# EAGLE design tube-driver_sch-pcb (EAGLE 9.5.1)

## Sheet 1 of 4: CONTROL
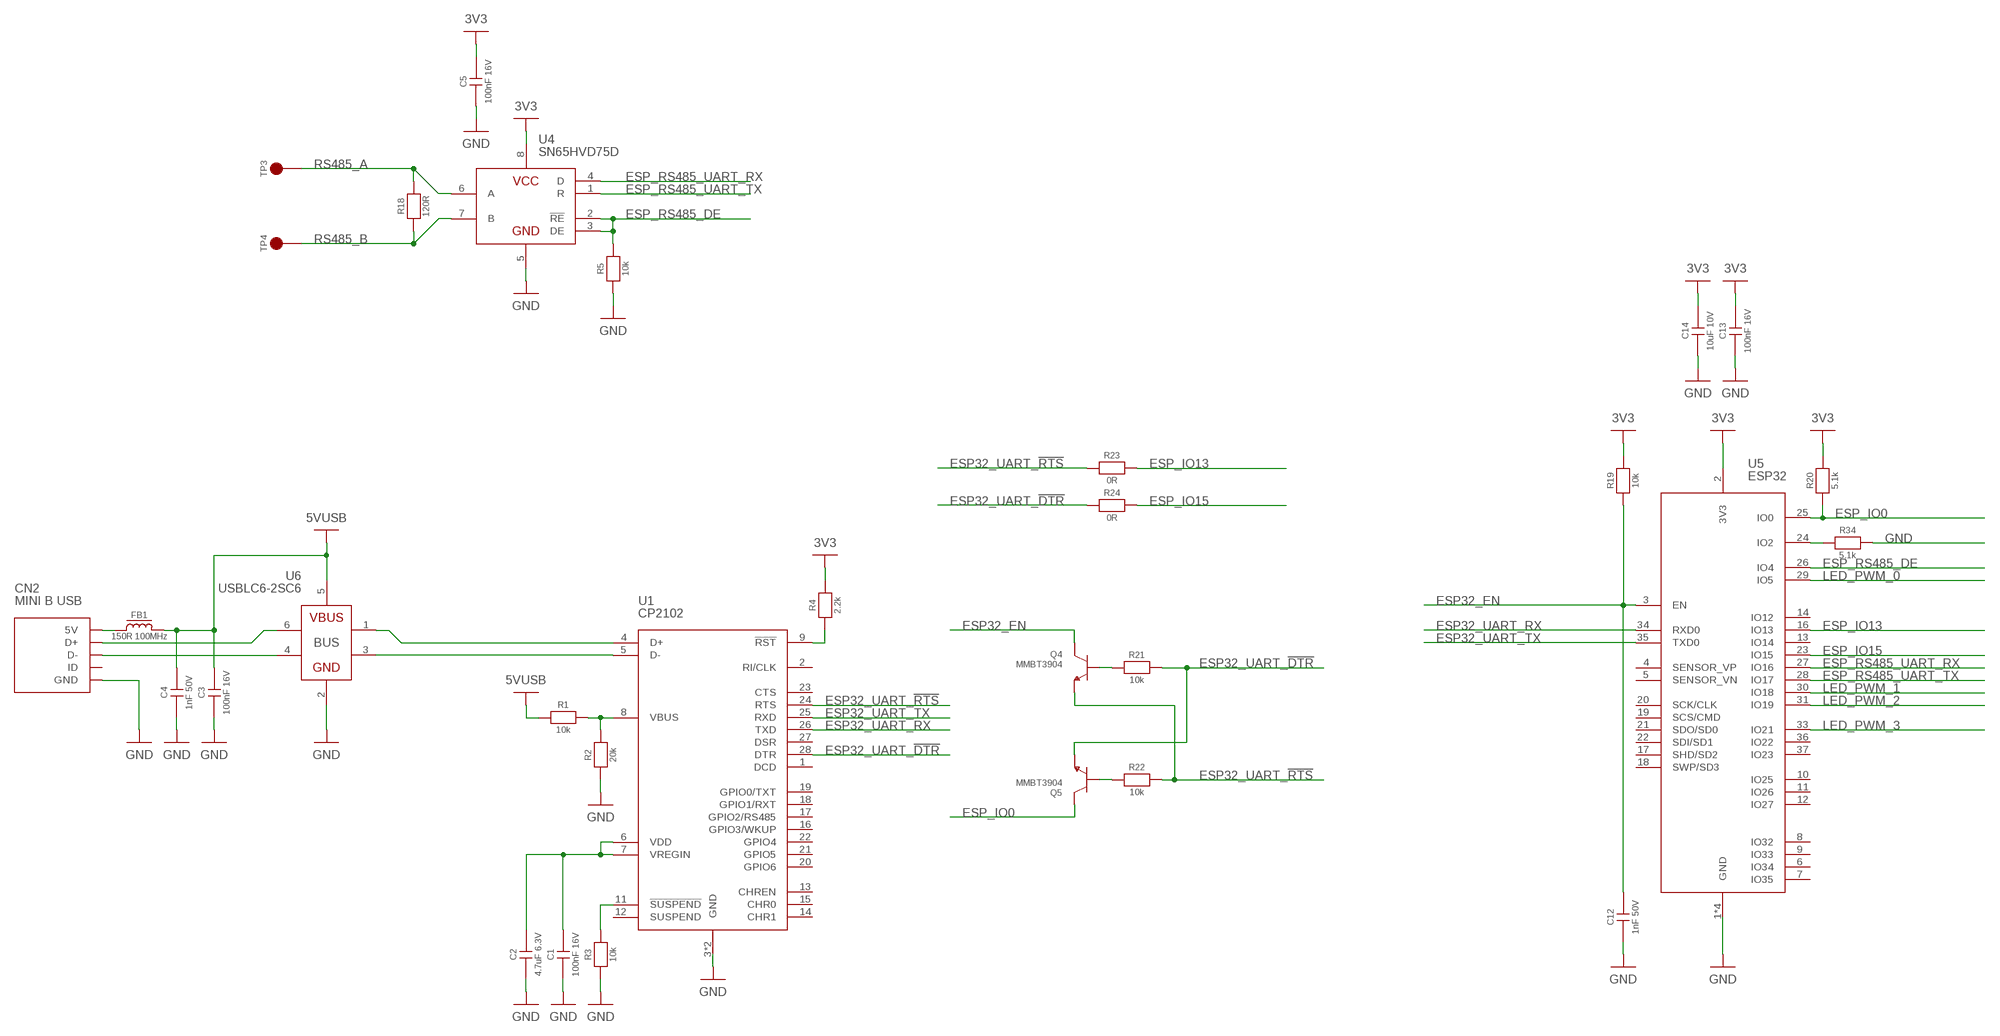
[diagram p0: schematic, sheet 1]

### Parts
C1  100nF 16V  CL10B104KO8WPNC  [0603]
C2  4.7uF 6.3V  GRM188R60J475ME19D  [0603]
C3  100nF 16V  CL10B104KO8WPNC  [0603]
C4  1nF 50V  CL10B102KB8NNNC  [0603]
C5  100nF 16V  CL10B104KO8WPNC  [0603]
C12  1nF 50V  CL10B102KB8NNNC  [0603]
C13  100nF 16V  CL10B104KO8WPNC  [0603]
C14  10uF 10V  GRM188R61A106KE69D  [0603]
CN2  MINI B USB  MUSB-05-S-B-SM-A  [MUSB-05-S-B-SM-A]
FB1  150R 100MHz  ILB1206ER151V  [1206]
Q4  MMBT3904  MMBT3904-7-F  [SOT23-3]
Q5  MMBT3904  MMBT3904-7-F  [SOT23-3]
R1  10k  ERJ3EKF1002V  [0603]
R2  20k  ERJ3EKF2002V  [0603]
R3  10k  ERJ3EKF1002V  [0603]
R4  2.2k  ERJ3EKF2201V  [0603]
R5  10k  ERJ3EKF1002V  [0603]
R18  120R  ERJ3EKF1200V  [0603]
R19  10k  ERJ3EKF1002V  [0603]
R20  5.1k  ERJ3EKF5101V  [0603]
R21  10k  ERJ3EKF1002V  [0603]
R22  10k  ERJ3EKF1002V  [0603]
R23  0R  CRCW06030000Z0EA  [0603]
R24  0R  CRCW06030000Z0EA  [0603]
R34  5.1k  ERJ3EKF5101V  [0603]
TP3  2MM_TEST_POINT  [2MM_TEST_PAD]
TP4  2MM_TEST_POINT  [2MM_TEST_PAD]
U1  CP2102  CP2102N-A01-GQFN28  [QFN28]
U4  SN65HVD75D  [SO8]
U5  ESP32  ESP32-WROOM-32D  [ESP32-WROOM-32D]
U6  USBLC6-2SC6  [SOT23-6]

### Nets
3V3: C5.2 C13.2 C14.2 R4.2 R19.2 R20.2 U4.8(VCC) U5.2(3V3) ; also sheet 3
5VUSB: C3.2 C4.2 FB1.2 R1.1 U6.5(VBUS) ; also sheet 3
ESP32_EN: C12.2 Q4.2(C) R19.1 U5.3(EN)
ESP32_UART_!DTR: Q5.3(E) R21.2 R24.1 U1.28(DTR)
ESP32_UART_!RTS: Q4.3(E) R22.2 R23.1 U1.24(RTS)
ESP32_UART_RX: U1.26(TXD) U5.34(RXD0)
ESP32_UART_TX: U1.25(RXD) U5.35(TXD0)
ESP_IO0: Q5.2(C) R20.1 U5.25(IO0)
ESP_IO13: R23.2 U5.16(IO13)
ESP_IO15: R24.2 U5.23(IO15)
ESP_RS485_DE: R5.2 U4.2(!RE) U4.3(DE) U5.26(IO4)
ESP_RS485_UART_RX: U4.4(D) U5.27(IO16)
ESP_RS485_UART_TX: U4.1(R) U5.28(IO17)
GND: C1.1 C2.1 C3.1 C4.1 C5.1 C12.1 C13.1 C14.1 CN2.GND CN2.SHIELD1(GND) CN2.SHIELD2(GND) CN2.SHIELD3(GND) CN2.SHIELD4(GND) R2.1 R3.1 R5.1 R34.2 U1.3(GND) U1.29(GND) U4.5(GND) U5.1(GND) U5.15(GND) U5.38(GND) U5.39(GND) U6.2(GND) ; also sheet 2,3
LED_PWM_0: U5.29(IO5) ; also sheet 2
LED_PWM_1: U5.30(IO18) ; also sheet 2
LED_PWM_2: U5.31(IO19) ; also sheet 2
LED_PWM_3: U5.33(IO21) ; also sheet 2
N$1: R1.2 R2.2 U1.8(VBUS)
N$2: R4.1 U1.9(!RST)
N$3: R3.2 U1.11(!SUSPEND)
N$7: C1.2 C2.2 U1.6(VDD) U1.7(VREGIN)
N$13: R34.1 U5.24(IO2)
N$20: CN2.VCC(5V) FB1.1
N$95: CN2.D- U6.4(D-OUT)
N$96: CN2.D+ U6.6(D+_OUT)
N$97: U1.5(D-) U6.3(D-_IN)
N$98: U1.4(D+) U6.1(D+_IN)
N$99: Q4.1(B) R21.1
N$100: Q5.1(B) R22.1
RS485_A: R18.2 TP3.1 U4.6(A)
RS485_B: R18.1 TP4.1 U4.7(B)
Unconnected: CN2.ID U1.1(DCD) U1.2(RI/CLK) U1.12(SUSPEND) U1.13(CHREN) U1.14(CHR1) U1.15(CHR0) U1.16(GPIO3/WKUP) U1.17(GPIO2/RS485) U1.18(GPIO1/RXT) U1.19(GPIO0/TXT) U1.20(GPIO6) U1.21(GPIO5) U1.22(GPIO4) U1.23(CTS) U1.27(DSR) U5.4(SENSOR_VP) U5.5(SENSOR_VN) U5.6(IO34) U5.7(IO35) U5.8(IO32) U5.9(IO33) U5.10(IO25) U5.11(IO26) U5.12(IO27) U5.13(IO14) U5.14(IO12) U5.17(SHD/SD2) U5.18(SWP/SD3) U5.19(SCS/CMD) U5.20(SCK/CLK) U5.21(SDO/SD0) U5.22(SDI/SD1) U5.36(IO22) U5.37(IO23)

## Sheet 2 of 4: LEDS
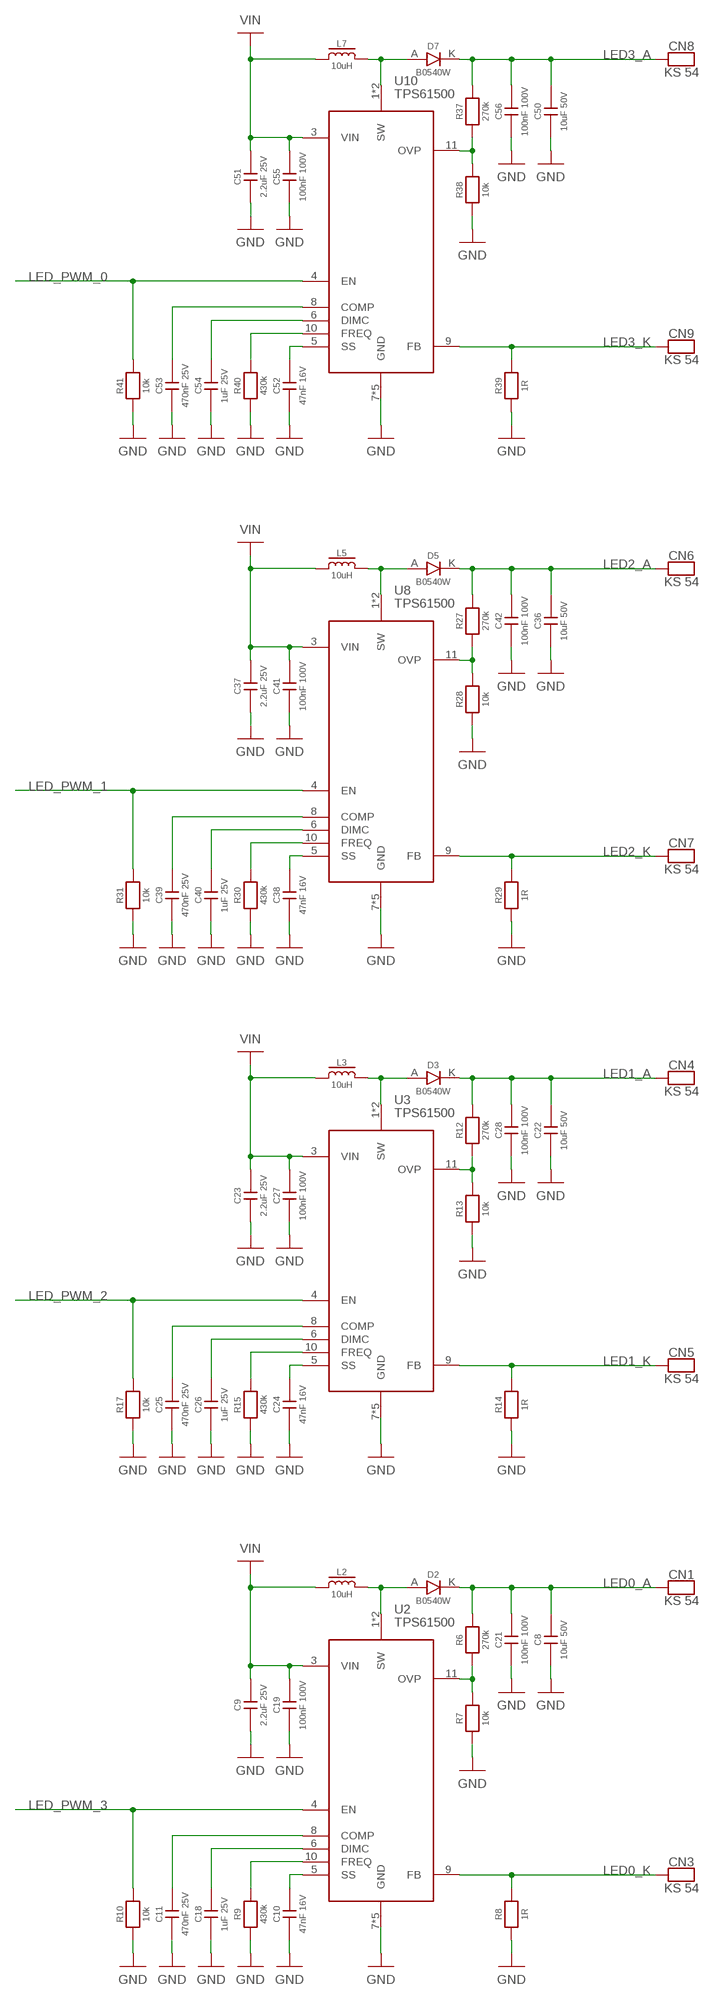
[diagram p1: schematic, sheet 2]

### Parts
C8  10uF 50V  C3225X7S1H106M250AB  [1210]
C9  2.2uF 25V  GRM188R61E225KA12D  [0603]
C10  47nF 16V  CL10B473KO8NNNC  [0603]
C11  470nF 25V  GRM188R71E474KA12D  [0603]
C18  1uF 25V  CL10A105KA8NNNC  [0603]
C19  100nF 100V  06031C104KAT2A  [0603]
C21  100nF 100V  06031C104KAT2A  [0603]
C22  10uF 50V  C3225X7S1H106M250AB  [1210]
C23  2.2uF 25V  GRM188R61E225KA12D  [0603]
C24  47nF 16V  CL10B473KO8NNNC  [0603]
C25  470nF 25V  GRM188R71E474KA12D  [0603]
C26  1uF 25V  CL10A105KA8NNNC  [0603]
C27  100nF 100V  06031C104KAT2A  [0603]
C28  100nF 100V  06031C104KAT2A  [0603]
C36  10uF 50V  C3225X7S1H106M250AB  [1210]
C37  2.2uF 25V  GRM188R61E225KA12D  [0603]
C38  47nF 16V  CL10B473KO8NNNC  [0603]
C39  470nF 25V  GRM188R71E474KA12D  [0603]
C40  1uF 25V  CL10A105KA8NNNC  [0603]
C41  100nF 100V  06031C104KAT2A  [0603]
C42  100nF 100V  06031C104KAT2A  [0603]
C50  10uF 50V  C3225X7S1H106M250AB  [1210]
C51  2.2uF 25V  GRM188R61E225KA12D  [0603]
C52  47nF 16V  CL10B473KO8NNNC  [0603]
C53  470nF 25V  GRM188R71E474KA12D  [0603]
C54  1uF 25V  CL10A105KA8NNNC  [0603]
C55  100nF 100V  06031C104KAT2A  [0603]
C56  100nF 100V  06031C104KAT2A  [0603]
CN1  KS 54  KEYSTONE_54  [KEYSTONE_54]
CN3  KS 54  KEYSTONE_54  [KEYSTONE_54]
CN4  KS 54  KEYSTONE_54  [KEYSTONE_54]
CN5  KS 54  KEYSTONE_54  [KEYSTONE_54]
CN6  KS 54  KEYSTONE_54  [KEYSTONE_54]
CN7  KS 54  KEYSTONE_54  [KEYSTONE_54]
CN8  KS 54  KEYSTONE_54  [KEYSTONE_54]
CN9  KS 54  KEYSTONE_54  [KEYSTONE_54]
D2  B0540W  [SOD-123]
D3  B0540W  [SOD-123]
D5  B0540W  [SOD-123]
D7  B0540W  [SOD-123]
L2  10uH  SRN6045-100M  [SRN6045]
L3  10uH  SRN6045-100M  [SRN6045]
L5  10uH  SRN6045-100M  [SRN6045]
L7  10uH  SRN6045-100M  [SRN6045]
R6  270k  ERJ3EKF2703V  [0603]
R7  10k  ERJ3EKF1002V  [0603]
R8  1R  CRCW12061R00FKEA  [1206]
R9  430k  ERJ3EKF4303V  [0603]
R10  10k  ERJ3EKF1002V  [0603]
R12  270k  ERJ3EKF2703V  [0603]
R13  10k  ERJ3EKF1002V  [0603]
R14  1R  CRCW12061R00FKEA  [1206]
R15  430k  ERJ3EKF4303V  [0603]
R17  10k  ERJ3EKF1002V  [0603]
R27  270k  ERJ3EKF2703V  [0603]
R28  10k  ERJ3EKF1002V  [0603]
R29  1R  CRCW12061R00FKEA  [1206]
R30  430k  ERJ3EKF4303V  [0603]
R31  10k  ERJ3EKF1002V  [0603]
R37  270k  ERJ3EKF2703V  [0603]
R38  10k  ERJ3EKF1002V  [0603]
R39  1R  CRCW12061R00FKEA  [1206]
R40  430k  ERJ3EKF4303V  [0603]
R41  10k  ERJ3EKF1002V  [0603]
U2  TPS61500  [HTSSOP14-4.5]
U3  TPS61500  [HTSSOP14-4.5]
U8  TPS61500  [HTSSOP14-4.5]
U10  TPS61500  [HTSSOP14-4.5]

### Nets
GND: C8.1 C9.1 C10.1 C11.1 C18.1 C19.1 C21.1 C22.1 C23.1 C24.1 C25.1 C26.1 C27.1 C28.1 C36.1 C37.1 C38.1 C39.1 C40.1 C41.1 C42.1 C50.1 C51.1 C52.1 C53.1 C54.1 C55.1 C56.1 R7.1 R8.1 R9.1 R10.1 R13.1 R14.1 R15.1 R17.1 R28.1 R29.1 R30.1 R31.1 R38.1 R39.1 R40.1 R41.1 U2.7(GND) U2.12(GND) U2.13(GND) U2.14(GND) U2.PAD(GND) U3.7(GND) U3.12(GND) U3.13(GND) U3.14(GND) U3.PAD(GND) U8.7(GND) U8.12(GND) U8.13(GND) U8.14(GND) U8.PAD(GND) U10.7(GND) U10.12(GND) U10.13(GND) U10.14(GND) U10.PAD(GND) ; also sheet 1,3
LED0_A: C8.2 C21.2 CN1.P$1 CN1.P$2 CN1.P$3 D2.K R6.2
LED0_K: CN3.P$1 CN3.P$2 CN3.P$3 R8.2 U2.9(FB)
LED1_A: C22.2 C28.2 CN4.P$1 CN4.P$2 CN4.P$3 D3.K R12.2
LED1_K: CN5.P$1 CN5.P$2 CN5.P$3 R14.2 U3.9(FB)
LED2_A: C36.2 C42.2 CN6.P$1 CN6.P$2 CN6.P$3 D5.K R27.2
LED2_K: CN7.P$1 CN7.P$2 CN7.P$3 R29.2 U8.9(FB)
LED3_A: C50.2 C56.2 CN8.P$1 CN8.P$2 CN8.P$3 D7.K R37.2
LED3_K: CN9.P$1 CN9.P$2 CN9.P$3 R39.2 U10.9(FB)
LED_PWM_0: R41.2 U10.4(EN) ; also sheet 1
LED_PWM_1: R31.2 U8.4(EN) ; also sheet 1
LED_PWM_2: R17.2 U3.4(EN) ; also sheet 1
LED_PWM_3: R10.2 U2.4(EN) ; also sheet 1
N$6: C10.2 U2.5(SS)
N$8: R9.2 U2.10(FREQ)
N$9: C18.2 U2.6(DIMC)
N$10: C11.2 U2.8(COMP)
N$11: R6.1 R7.2 U2.11(OVP)
N$12: D2.A L2.2 U2.1(SW) U2.2(SW)
N$14: C24.2 U3.5(SS)
N$15: R15.2 U3.10(FREQ)
N$16: C26.2 U3.6(DIMC)
N$17: C25.2 U3.8(COMP)
N$18: R12.1 R13.2 U3.11(OVP)
N$19: D3.A L3.2 U3.1(SW) U3.2(SW)
N$26: C38.2 U8.5(SS)
N$27: R30.2 U8.10(FREQ)
N$28: C40.2 U8.6(DIMC)
N$29: C39.2 U8.8(COMP)
N$30: R27.1 R28.2 U8.11(OVP)
N$31: D5.A L5.2 U8.1(SW) U8.2(SW)
N$38: C52.2 U10.5(SS)
N$39: R40.2 U10.10(FREQ)
N$40: C54.2 U10.6(DIMC)
N$41: C53.2 U10.8(COMP)
N$42: R37.1 R38.2 U10.11(OVP)
N$43: D7.A L7.2 U10.1(SW) U10.2(SW)
VIN: C9.2 C19.2 C23.2 C27.2 C37.2 C41.2 C51.2 C55.2 L2.1 L3.1 L5.1 L7.1 U2.3(VIN) U3.3(VIN) U8.3(VIN) U10.3(VIN) ; also sheet 3

## Sheet 3 of 4: PSU
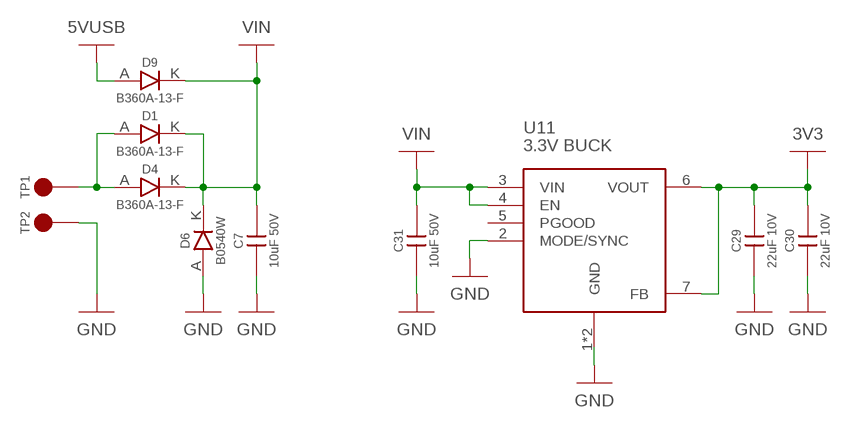
[diagram p2: schematic, sheet 3]

### Parts
C7  10uF 50V  C3225X7S1H106M250AB  [1210]
C29  22uF 10V  CL31B226MPHNNNE  [1206]
C30  22uF 10V  CL31B226MPHNNNE  [1206]
C31  10uF 50V  C3225X7S1H106M250AB  [1210]
D1  B360A-13-F  [DO214AC]
D4  B360A-13-F  [DO214AC]
D6  B0540W  [SOD-123]
D9  B360A-13-F  [DO214AC]
TP1  2MM_TEST_POINT  [2MM_TEST_PAD]
TP2  2MM_TEST_POINT  [2MM_TEST_PAD]
U11  3.3V BUCK  LMZM23600V3SILT  [TI_MICROSIP_10]

### Nets
3V3: C29.2 C30.2 U11.6(VOUT) U11.7(FB) ; also sheet 1
5VUSB: D9.A ; also sheet 1
GND: C7.1 C29.1 C30.1 C31.1 D6.A TP2.1 U11.1(GND) U11.2(MODE/SYNC) U11.PAD(GND) ; also sheet 1,2
N$5: D1.A D4.A TP1.1
VIN: C7.2 C31.2 D1.K D4.K D6.K D9.K U11.3(VIN) U11.4(EN) ; also sheet 2
Unconnected: U11.5(PGOOD)

## Sheet 4 of 4
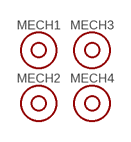
[diagram p3: schematic, sheet 4]

### Parts
MECH1  6mm x 3mm  MOUNTHOLE  [MOUNTHOLE_6X3]
MECH2  6mm x 3mm  MOUNTHOLE  [MOUNTHOLE_6X3]
MECH3  6mm x 3mm  MOUNTHOLE  [MOUNTHOLE_6X3]
MECH4  6mm x 3mm  MOUNTHOLE  [MOUNTHOLE_6X3]

## Library data of the parts
C1 C3 C5 C13 = CAPACITORS:CL10B104KO8WPNC: 100nF 16V X7R 10% 0603 MLCC; DIGIKEY: 1276-6582-1-ND; HEIGHT: 1; PRICE_PER: 0.08
C2 = CAPACITORS:GRM188R60J475ME19D: 4.7uF 6.3V X5R 10% 0603 MLCC.; FARNELL: 2362095; HEIGHT: 1; PRICE_PER: 0.0414
C4 C12 = CAPACITORS:CL10B102KB8NNNC: 1nF 50V X7R 10% 0603 MLCC.; DIGIKEY: 1276-1018-1-ND; HEIGHT: 1; PRICE_PER: 0.08
C7 C8 C22 C31 C36 C50 = CAPACITORS:C3225X7S1H106M250AB: 10uF 50V X7S 20% 1210 MLCC.; DIGIKEY: 445-4537-1-ND; HEIGHT: 3; PRICE_PER: 0.583
C9 C23 C37 C51 = CAPACITORS:GRM188R61E225KA12D: 2.2uF 25V X5R 10% 0603 MLCC.; DIGIKEY: 490-10731-1-ND; HEIGHT: 1; PRICE_PER: 0.14
C10 C24 C38 C52 = CAPACITORS:CL10B473KO8NNNC: 47nF 16V X7R 10% 0603 MLCC.; DIGIKEY: 1276-2079-1-ND; HEIGHT: 1; PRICE_PER: 0.08
C11 C25 C39 C53 = CAPACITORS:GRM188R71E474KA12D: 470nF 25V X7R 10% 0603 MLCC.; DIGIKEY: 490-3291-1-ND; HEIGHT: 1; PRICE_PER: 0.2
C14 = CAPACITORS:GRM188R61A106KE69D: 10uF 10V X5R 10% 0603 MLCC.; DIGIKEY: 490-10474-1-ND; HEIGHT: 0.95; PRICE_PER: 0.17
C18 C26 C40 C54 = CAPACITORS:CL10A105KA8NNNC: 1uF 25V X5R 10% 0603 MLCC.; DIGIKEY: 1276-1102-1-ND; HEIGHT: 1; PRICE_PER: 0.08
C19 C21 C27 C28 C41 C42 C55 C56 = CAPACITORS:06031C104KAT2A: 100nF 100V X7R 10% 0603 MLCC.; DIGIKEY: 478-10047-1-ND; HEIGHT: 1; PRICE_PER: 0.14
C29 C30 = CAPACITORS:CL31B226MPHNNNE: 22uF 10V X7R 10% 1206 MLCC.; DIGIKEY: 1276-3148-6-ND; HEIGHT: 1.8; PRICE_PER: 0.47
CN1 CN3-CN9 = CONNECTORs:KEYSTONE_54: Battery Contact Clip 18650 1 Cell PC Pin; DIGIKEY: 36-54-ND; HEIGHT: 17; PRICE_PER: 0.46
CN2 = CONNECTORs:MUSB-05-S-B-SM-A: 5 pin, SMD, mini USB connector.; DIGIKEY: SAM8841-ND; HEIGHT: 4; PRICE_PER: 1.11
D1 D4 D9 = DIODES:B360A-13-F: Schottky Rectifier, 60 V, 3 A, Single, DO-214AC, 2 Pins, 700 mV; DIGIKEY: B360A-FDICT-ND; HEIGHT: 2; PRICE_PER: 0.31
D2 D3 D5-D7 = DIODES:B0540W: 410mW, Low VF SMD Schottky Barrier Diode; DIGIKEY: B0540W-FDICT-ND; HEIGHT: 1; PRICE_PER: 0.153
FB1 = INDUCTORS:ILB1206ER151V: Ferrite bead, 100MHz, 150R, 0.8A, 1206; DIGIKEY: 541-2281-1-ND; HEIGHT: 1.5; PRICE_PER: 0.14
L2 L3 L5 L7 = INDUCTORS:SRN6045-100M: BOURNS SRN6045-100M Surface Mount Power Inductor, SRN6045 Series, 10 µH, 2.5 A, 3 A, Shielded, 0.0586 ohm; DIGIKEY: SRN6045-100MCT-ND; HEIGHT: 5; PRICE_PER: 0.45
MECH1-MECH4 = MISC:MOUNTHOLE: Mechanical mounting hole.
Q4 Q5 = TRANSISTORs:MMBT3904-7-F: Bipolar (BJT) Transistor NPN 40V 200mA 300MHz 300mW Surface Mount SOT-23-3; DIGIKEY: MMBT3904-FDICT-ND; HEIGHT: 0.8; PRICE_PER: 0.1
R1 R3 R5 R7 R10 R13 R17 R19 R21 R22 R28 R31 R38 R41 = r_0603:ERJ3EKF1002V: 10000 10k 0603 0.1W 1% thick film resistor.; DIGIKEY: P10.0KHCT-ND; PRICE_PER: 0.10000
R2 = r_0603:ERJ3EKF2002V: 20000 20k 0603 0.1W 1% thick film resistor.; DIGIKEY: P20.0KHCT-ND; PRICE_PER: 0.10000
R4 = r_0603:ERJ3EKF2201V: 2200 2.2k 0603 0.1W 1% thick film resistor.; DIGIKEY: P2.20KHCT-ND; PRICE_PER: 0.10000
R6 R12 R27 R37 = r_0603:ERJ3EKF2703V: 270000 270k 0603 0.1W 1% thick film resistor.; DIGIKEY: P270KHCT-ND; PRICE_PER: 0.10000
R8 R14 R29 R39 = RESISTORS:CRCW12061R00FKEA: 1 1R0 1206 0.25W 1% thick film resistor.; DIGIKEY: 541-1.00FFCT-ND; HEIGHT: 0.65; PRICE_PER: 0.08
R9 R15 R30 R40 = r_0603:ERJ3EKF4303V: 430000 430k 0603 0.1W 1% thick film resistor.; DIGIKEY: P430KHCT-ND; PRICE_PER: 0.10000
R18 = r_0603:ERJ3EKF1200V: 120 120R 0603 0.1W 1% thick film resistor.; DIGIKEY: P120HCT-ND; PRICE_PER: 0.10000
R20 R34 = r_0603:ERJ3EKF5101V: 5100 5.1k 0603 0.1W 1% thick film resistor.; DIGIKEY: P5.10KHCT-ND; PRICE_PER: 0.10000
R23 R24 = RESISTORS:CRCW06030000Z0EA: 0 0R 0603 0.1W thick film resistor; DIGIKEY: 541-0.0GCT-ND; HEIGHT: 0.5; PRICE_PER: 0.08
TP1-TP4 = MISC:2MM_TEST_POINT: A 2MM round pad for test purposes.
U1 = ICs:CP2102N-A01-GQFN28: USB Bridge, USB to UART USB 2.0 UART Interface 28-QFN (5x5); DIGIKEY: 336-3694-ND; HEIGHT: 1.2; PRICE_PER: 1.09
U2 U3 U8 U10 = ICs:TPS61500: TPS61500 High-Brightness, LED Driver With Integrated 3-A, 40-V Power Switch; DIGIKEY: 296-24014-1-ND; HEIGHT: 1; PRICE_PER: 1.95
U4 = ICs:SN65HVD75D: 3.3-V Supply RS-485 With IEC ESD protection; DIGIKEY: 296-38570-1-ND; HEIGHT: 1.8; PRICE_PER: 2.09
U5 = ICs:ESP32-WROOM-32D: Bluetooth, WiFi 802.11b/g/n, Bluetooth v4.2 + EDR, Class 1, 2 and 3 Transceiver Module 2.4GHz ~ 2.5GHz Integrated, Trace Surface Mount; DIGIKEY: 1904-1023-1-ND; HEIGHT: 5; PRICE_PER: 3.01
U6 = ICs:USBLC6-2SC6: Very low capacitance ESD protection; DIGIKEY: 497-5235-1-ND; HEIGHT: 1.5; PRICE_PER: 0.38
U11 = ICs:LMZM23600V3SILT: 36-V, 0.5-A Step-Down DC/DC Power Module in 3.8-mm × 3-mm Package; DIGIKEY: 296-49458-1-ND; HEIGHT: 1.6; PRICE_PER: 4.24

## Board
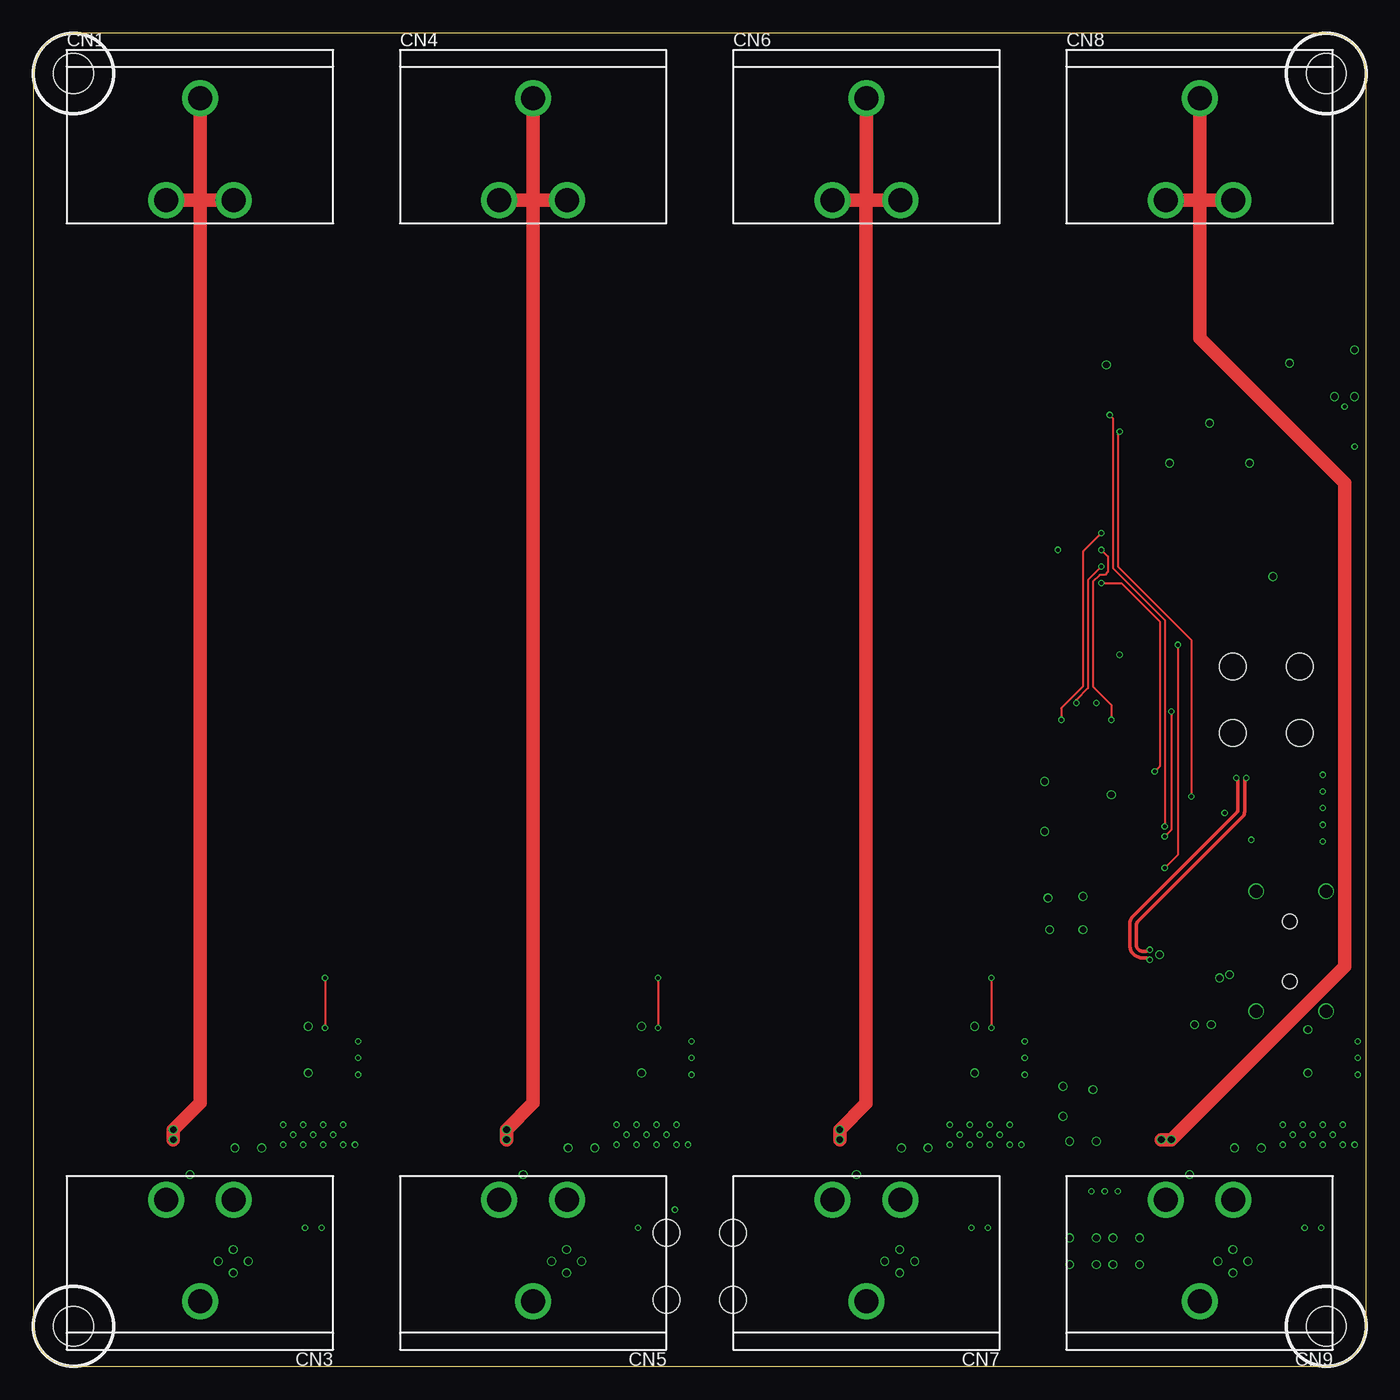
[diagram p4: board, top side]
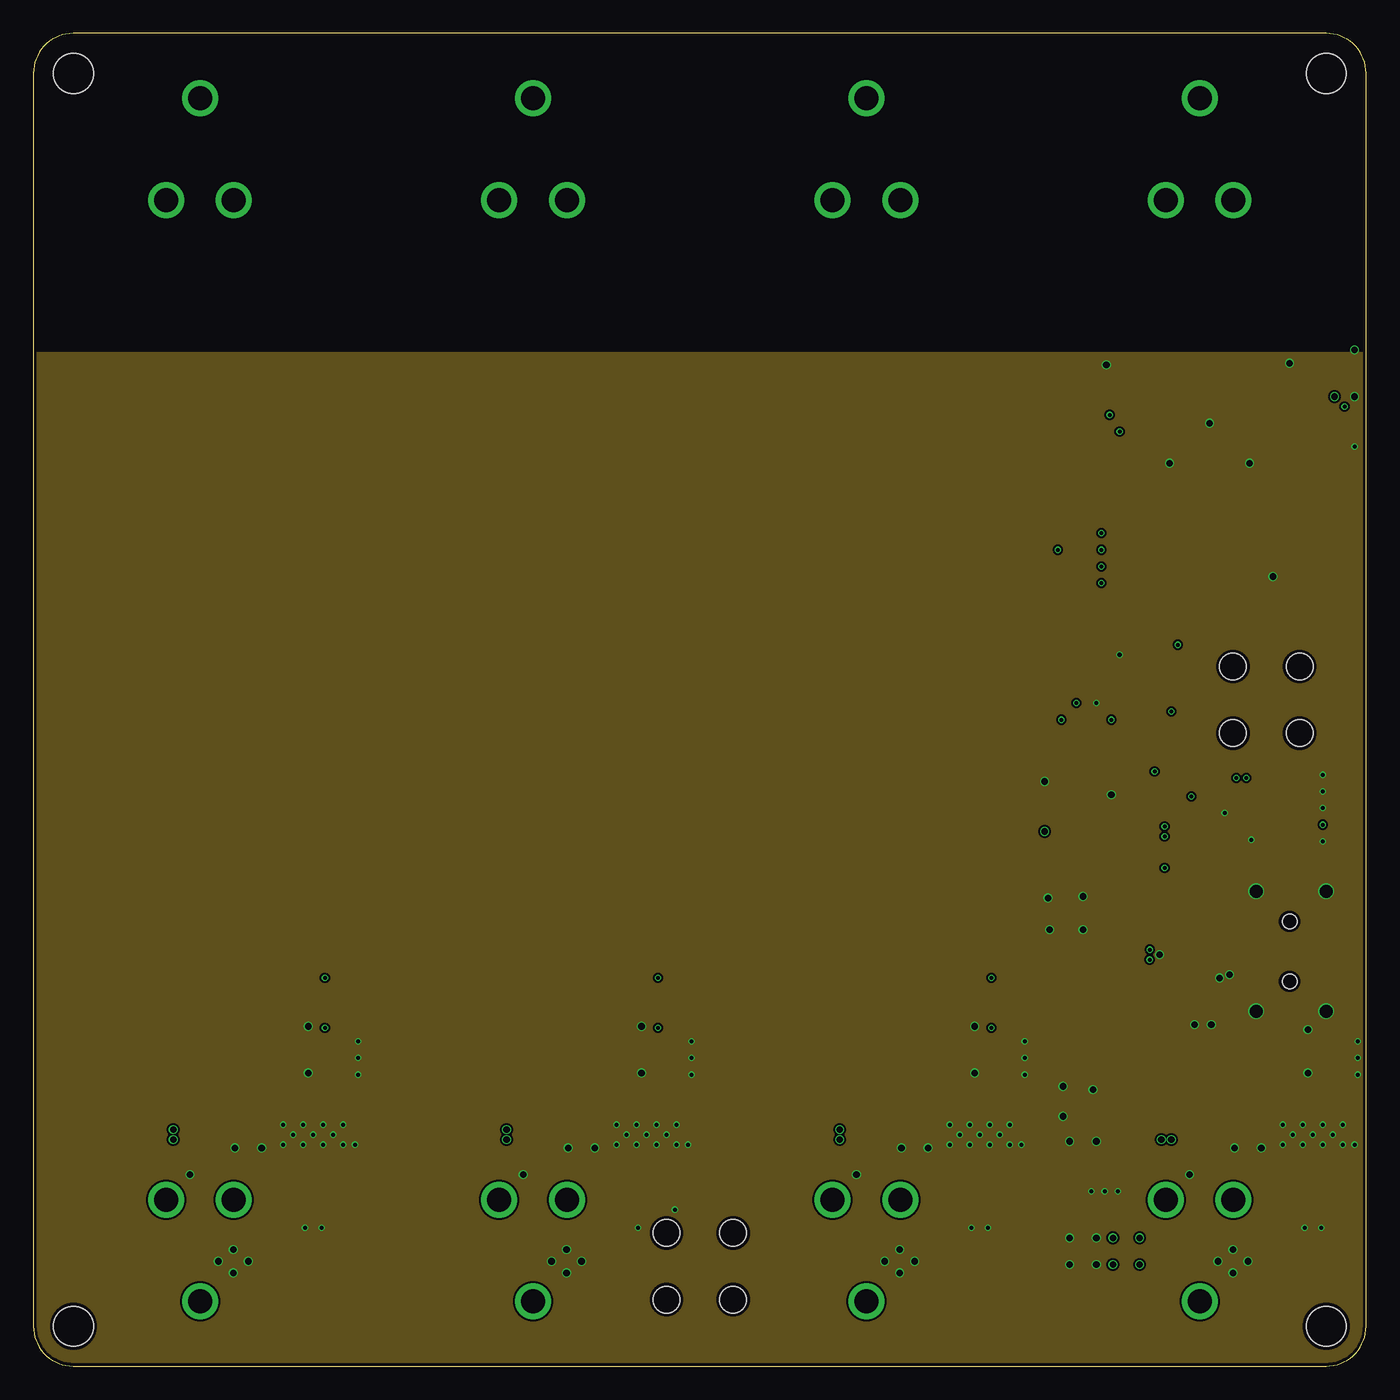
[diagram p5: board, inner layer GND]
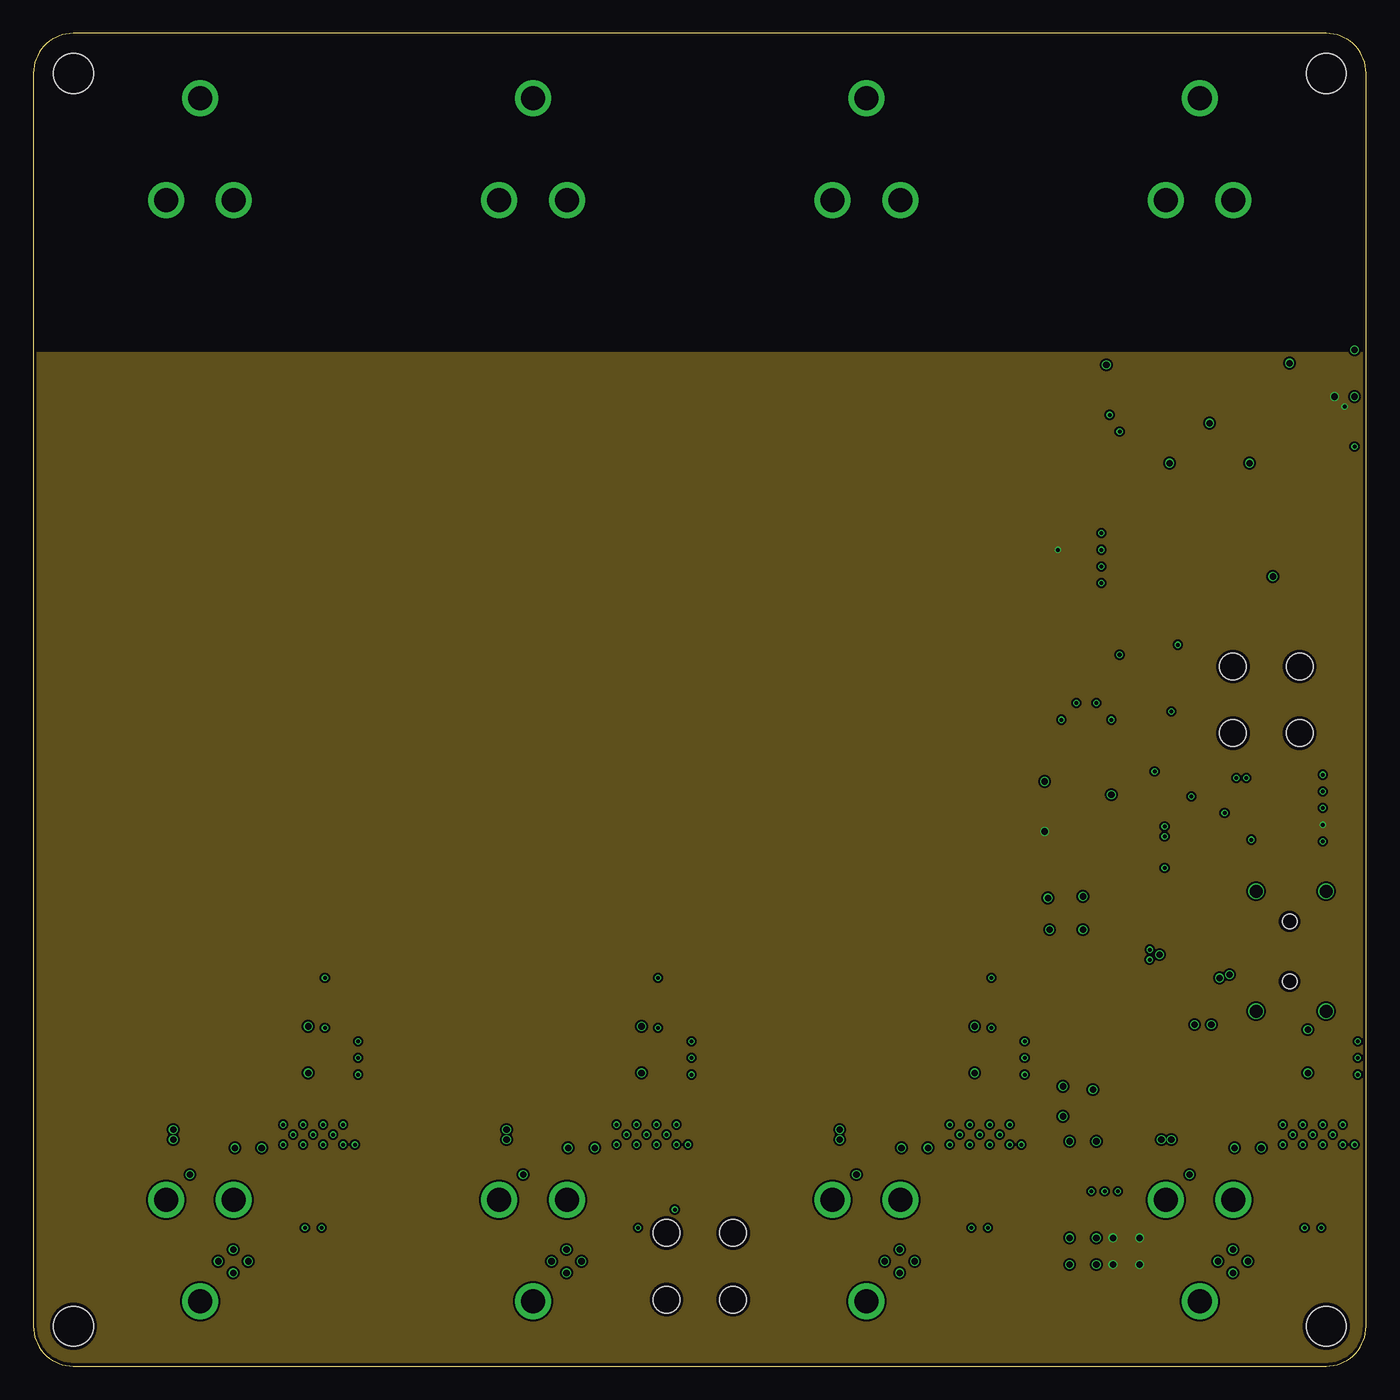
[diagram p6: board, inner layer PWR]
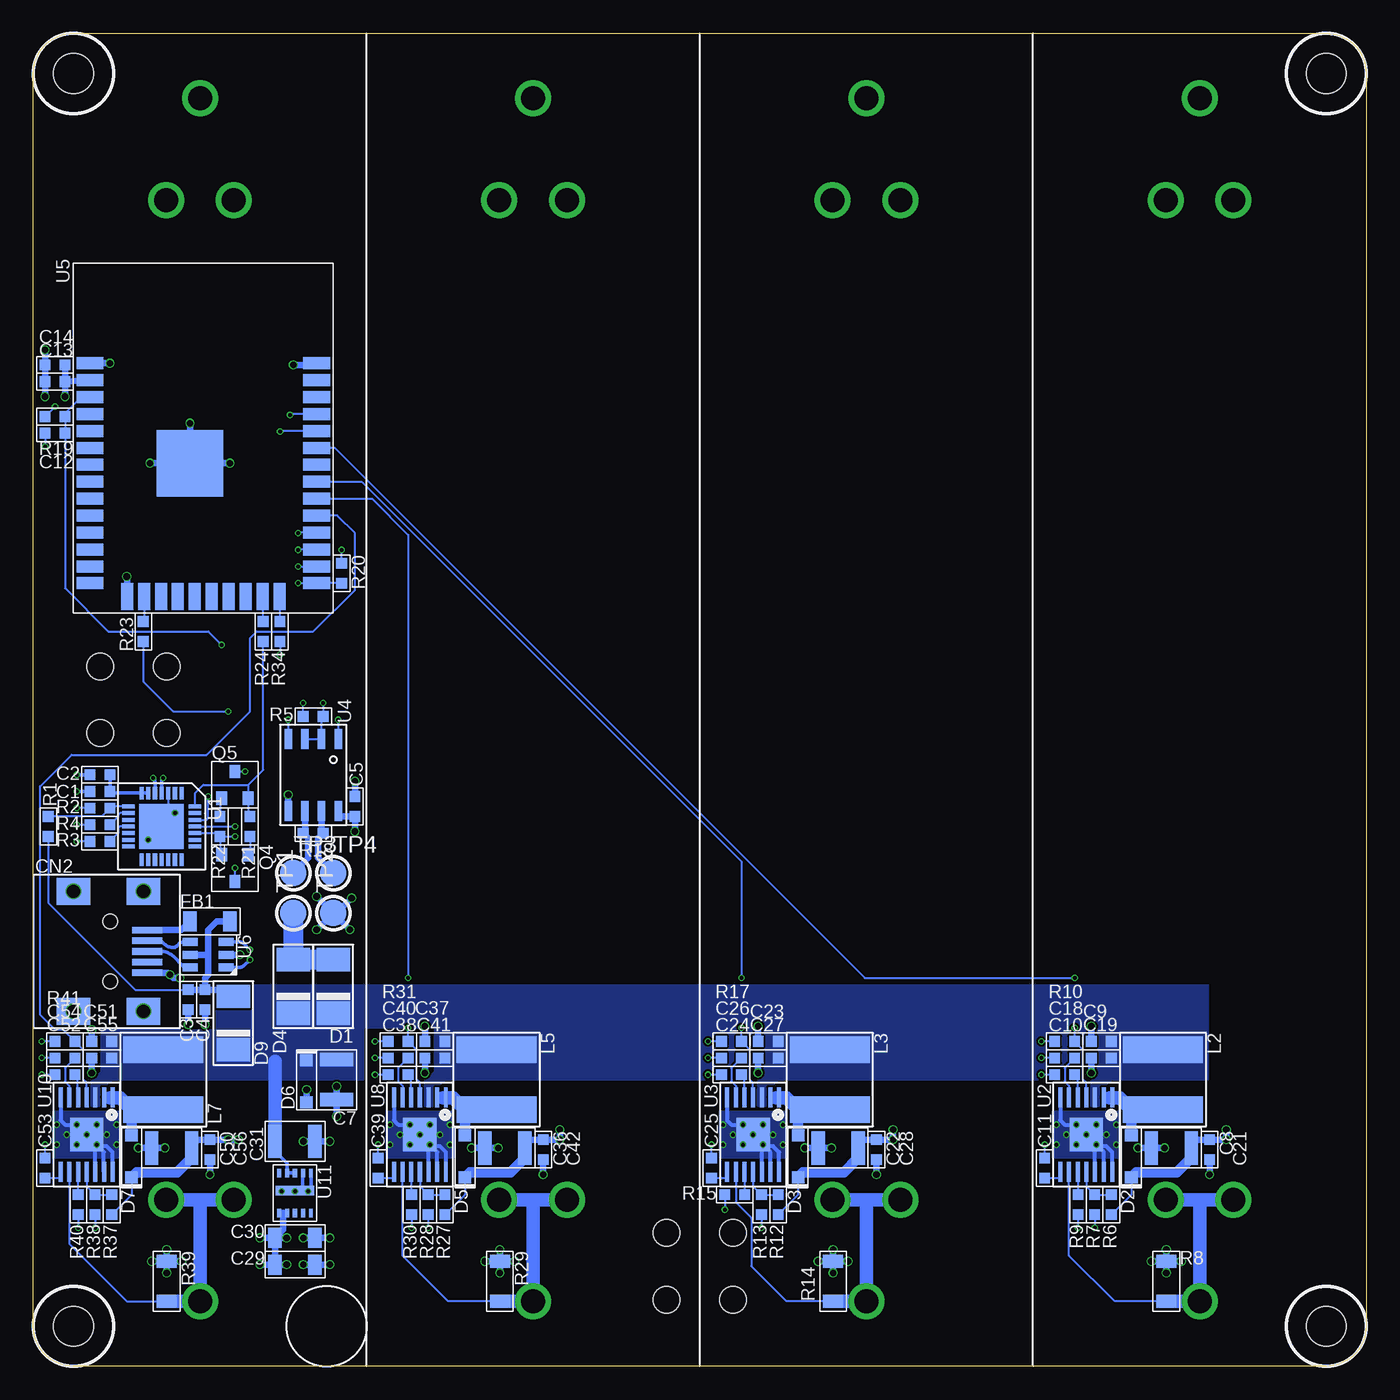
[diagram p7: board, bottom side, seen from below]

Size 100 x 100 mm. Coordinates in mm from the lower left corner, seen from the top.
Outline: 97,0 arc90 100,3 100,97 arc90 97,100 3,100 arc90 0,97 0,3 arc90 3,0 97,0
Copper layers (1*2*3*16): Top 0.035mm / dielectric 1.11mm / GND 0.035mm / dielectric 0.15mm / PWR 0.035mm / dielectric 0.2mm / Bottom 0.035mm
Design rules "myDRC 4 layers 0.15mm *": minimum track width 0.15mm, minimum drill 0.3mm, track to track 0.15mm, track to pad 0.15mm, pad to pad 0.15mm, via to via 0.15mm, smd to smd 0mil, copper to edge 0.25mm, drill to drill 0.25mm, minimum pad ring 10mil, minimum via ring 3mil, stop-mask expansion 4mil, vias tented up to drill 1mm, thermal gap 10mil
Holes 2 mm at 52.5,10 47.5,10 52.5,5 47.5,5 90,47.5 90,52.5 95,47.5 95,52.5

### Footprints (pad centres in the part's own frame; a part is rotated, then mirrored left to right if it is on the bottom)
0603 = smd 0.8 x 0.8: 1 -0.75,0; 2 0.75,0
1210 = smd 1 x 2.5: 1 -1.5,0; 2 1.5,0
1206 = smd 1 x 1.5: 1 1.5,0; 2 -1.5,0
KEYSTONE_54 = drill 1.8: P$1 -2.54,0; P$2 2.54,0; P$3 0,7.62
MUSB-05-S-B-SM-A = smd 0.5 x 2.25: D+ 0,2.8; D- -0.8,2.8; GND 1.6,2.8; ID 0.8,2.8; VCC -1.6,2.8 | smd 2 x 2.5: SHIELD1 -4.5,2.5; SHIELD2 4.5,2.5; SHIELD3 4.5,-2.75; SHIELD4 -4.5,-2.75 | hole 1.1: 2.25,0; -2.25,0
DO214AC = smd 1.75 x 2.5: A -2,0; K 2,0
SOD-123 = smd 0.9 x 0.95: A -1.575,0; K 1.575,0
SRN6045 = smd 2 x 6: 1 -2.25,0; 2 2.25,0
MOUNTHOLE_6X3 = hole 3: 0,0
SOT23-3 = smd 0.8 x 1: 1 -1,-1; 2 0,1; 3 1,-1
2MM_TEST_PAD = smd 2 x 2: 1 0,0
QFN28 = smd 0.95 x 0.3: 1 -2.5,1.5; 2 -2.5,1; 3 -2.5,0.5; 4 -2.5,0; 5 -2.5,-0.5; 6 -2.5,-1; 7 -2.5,-1.5; 15 2.5,-1.5; 16 2.5,-1; 17 2.5,-0.5; 18 2.5,0; 19 2.5,0.5; 20 2.5,1; 21 2.5,1.5 | smd 0.3 x 0.95: 8 -1.5,-2.5; 9 -1,-2.5; 10 -0.5,-2.5; 11 0,-2.5; 12 0.5,-2.5; 13 1,-2.5; 14 1.5,-2.5; 22 1.5,2.5; 23 1,2.5; 24 0.5,2.5; 25 0,2.5; 26 -0.5,2.5; 27 -1,2.5; 28 -1.5,2.5 | smd 3.35 x 3.35: 29 0,0
HTSSOP14-4.5 = smd 1.5 x 0.3: 1 -2.8,1.95; 2 -2.8,1.3; 3 -2.8,0.65; 4 -2.8,0; 5 -2.8,-0.65; 6 -2.8,-1.3; 7 -2.8,-1.95; 8 2.8,-1.95; 9 2.8,-1.3; 10 2.8,-0.65; 11 2.8,0; 12 2.8,0.65; 13 2.8,1.3; 14 2.8,1.95 | smd 2.5 x 2.5: PAD 0,0
SO8 = smd 1.5 x 0.55: 1 -2.7,1.875; 2 -2.7,0.625; 3 -2.7,-0.625; 4 -2.7,-1.875; 5 2.7,-1.875; 6 2.7,-0.625; 7 2.7,0.625; 8 2.7,1.875
ESP32-WROOM-32D = smd 2 x 0.9: 1 -8.5,5.25; 2 -8.5,3.98; 3 -8.5,2.71; 4 -8.5,1.44; 5 -8.5,0.17; 6 -8.5,-1.1; 7 -8.5,-2.37; 8 -8.5,-3.64; 9 -8.5,-4.91; 10 -8.5,-6.18; 11 -8.5,-7.45; 12 -8.5,-8.72; 13 -8.5,-9.99; 14 -8.5,-11.26; 25 8.5,-11.26; 26 8.5,-9.99; 27 8.5,-8.72; 28 8.5,-7.45; 29 8.5,-6.18; 30 8.5,-4.91; 31 8.5,-3.64; 32 8.5,-2.37; 33 8.5,-1.1; 34 8.5,0.17; 35 8.5,1.44; 36 8.5,2.71; 37 8.5,3.98; 38 8.5,5.25 | smd 0.9 x 2: 15 -5.715,-12.26; 16 -4.445,-12.26; 17 -3.175,-12.26; 18 -1.905,-12.26; 19 -0.635,-12.26; 20 0.635,-12.26; 21 1.905,-12.26; 22 3.175,-12.26; 23 4.445,-12.26; 24 5.715,-12.26 | smd 5 x 5: 39 -1,-2.25
SOT23-6 = smd 0.6 x 1.1: 1 0.95,1.35; 2 0,1.35; 3 -0.95,1.35; 4 -0.95,-1.35; 5 0,-1.35; 6 0.95,-1.35
TI_MICROSIP_10 = smd 0.65 x 0.3: 1 -1.5,1.2; 2 -1.5,0.6; 3 -1.5,0; 4 -1.5,-0.6; 5 -1.5,-1.2; 6 1.5,-1.2; 7 1.5,-0.6; 8 1.5,0; 9 1.5,0.6; 10 1.5,1.2 | smd 0.7 x 2.9: PAD -0.175,0

### Placement (x,y rotation side)
C1  95,43.12 0 bottom
C2  95,44.38 0 bottom
C3  88.38,27.5 90 bottom
C4  87.12,27.5 90 bottom
C5  75.88,42 270 bottom
C7  77.25,21.5 90 bottom
C8  14.62,16.38 0 bottom
C9  19.88,24.38 0 bottom
C10  22.62,21.88 0 bottom
C11  24.12,14.88 270 bottom
C12  98.38,70 0 bottom
C13  98.38,73.88 0 bottom
C14  98.38,75.12 0 bottom
C18  22.62,23.12 0 bottom
C19  19.88,23.12 0 bottom
C21  11.75,16.25 90 bottom
C22  39.62,16.38 0 bottom
C23  44.88,24.38 0 bottom
C24  47.62,21.88 0 bottom
C25  49.12,14.88 270 bottom
C26  47.62,23.12 0 bottom
C27  44.88,23.12 0 bottom
C28  36.75,16.25 90 bottom
C29  80.38,7.62 0 bottom
C30  80.38,9.62 0 bottom
C31  80.38,16.88 180 bottom
C36  64.62,16.38 0 bottom
C37  69.88,24.38 0 bottom
C38  72.62,21.88 0 bottom
C39  74.12,14.88 270 bottom
C40  72.62,23.12 0 bottom
C41  69.88,23.12 0 bottom
C42  61.75,16.25 90 bottom
C50  89.62,16.38 0 bottom
C51  94.88,24.38 0 bottom
C52  97.62,21.88 0 bottom
C53  99.12,14.88 270 bottom
C54  97.62,23.12 0 bottom
C55  94.88,23.12 0 bottom
C56  86.75,16.25 90 bottom
CN1  12.5,87.5 0 top
CN2  94.25,31.12 270 bottom
CN3  12.5,12.5 180 top
CN4  37.5,87.5 0 top
CN5  37.5,12.5 180 top
CN6  62.5,87.5 0 top
CN7  62.5,12.5 180 top
CN8  87.5,87.5 0 top
CN9  87.5,12.5 180 top
D1  77.5,28.5 270 bottom
D2  17.62,15.75 270 bottom
D3  42.62,15.75 270 bottom
D4  80.5,28.5 270 bottom
D5  67.62,15.75 270 bottom
D6  79.5,21.38 90 bottom
D7  92.62,15.75 270 bottom
D9  85,25.75 270 bottom
FB1  86.75,33.38 180 bottom
L2  15.25,21.5 270 bottom
L3  40.25,21.5 270 bottom
L5  65.25,21.5 270 bottom
L7  90.25,21.5 270 bottom
MECH1  3,3 0 top
MECH2  3,97 0 top
MECH3  97,3 0 top
MECH4  97,97 0 top
Q4  84.88,37.38 180 bottom
Q5  84.88,43.62 0 bottom
R1  98.88,40.5 90 bottom
R2  95,41.88 0 bottom
R3  95,39.38 0 bottom
R4  95,40.62 180 bottom
R5  79,48.75 0 bottom
R6  19.12,12.12 270 bottom
R7  20.38,12.12 90 bottom
R8  15,6.38 90 bottom
R9  21.62,12.12 90 bottom
R10  22.62,24.38 0 bottom
R12  44.12,12.12 270 bottom
R13  45.38,12.12 90 bottom
R14  40,6.38 90 bottom
R15  47.38,12.88 0 bottom
R17  47.62,24.38 0 bottom
R18  79,40 180 bottom
R19  98.38,71.25 180 bottom
R20  76.88,59.5 90 bottom
R21  83.75,40.5 90 bottom
R22  86,40.5 270 bottom
R23  91.75,55.12 90 bottom
R24  82.75,55.12 90 bottom
R27  69.12,12.12 270 bottom
R28  70.38,12.12 90 bottom
R29  65,6.38 90 bottom
R30  71.62,12.12 90 bottom
R31  72.62,24.38 0 bottom
R34  81.5,55.12 270 bottom
R37  94.12,12.12 270 bottom
R38  95.38,12.12 90 bottom
R39  90,6.38 90 bottom
R40  96.62,12.12 90 bottom
R41  97.62,24.38 0 bottom
TP1  80.5,34 270 bottom
TP2  77.5,34 0 bottom
TP3  80.5,37 0 bottom
TP4  77.5,37 0 bottom
U1  90.38,40.5 270 bottom
U2  21,17.38 270 bottom
U3  46,17.38 270 bottom
U4  79,44.38 270 bottom
U5  87.25,70 0 bottom
U6  86.88,30.88 270 bottom
U8  71,17.38 270 bottom
U10  96,17.38 270 bottom
U11  80.38,13 270 bottom

### Tracks (layer width: path | path; a pad name or v marks a point on that pad's centre or on a via)
3V3  (via drill 0.3, 0.5)
  Bottom 0.15: R20.2 v76.88,61.25 | R19.2 v98.38,72 | R4.2 v96.75,40.62
  Bottom 0.25: U11.6 81.25,11.5 U11.7
  Bottom 0.5: v97.62,72.75 C14.2 C13.2 95.77,74 U5.2 | C30.2 81.25,10.25 81.25,11.5 | C30.2 C29.2 | C30.2 v83,9.62 | C29.2 v83,7.62 | C30.2 v81,9.62 | C29.2 v81,7.62 | U4.8 77.12,41.25 C5.2 v75.88,40.12
  pour PWR (rank 6): 0,0 100,0 100,76 0,76
5VUSB
  Bottom 0.15: R1.1 98.88,34.75 92.38,28.25 C3.2
  Bottom 0.5: C3.2 C4.2 | C4.2 85.5,28.25 D9.A | FB1.2 86.25,33.38 86.88,32.75 86.88,30.88 | C4.2 87.12,29.12 86.88,29.38 86.88,30.88 | U6.5 86.88,30.88
ESP32_EN  (via drill 0.3)
  Top 0.15: v84.88,37.38 85.88,38.38 v85.88,54.12
  Bottom 0.15: Q4.2 v84.88,37.38 | U5.3 96.42,72.71 97.62,71.5 R19.1 C12.2 97.62,58.38 94.38,55.12 86.88,55.12 v85.88,54.12
ESP32_UART_!DTR
  Bottom 0.15: R21.2 83.88,41.38 Q5.3 83.88,43.62 | U1.28 87.88,43 87.25,43.62 83.88,43.62 | R24.1 82.75,44.75 83.88,43.62
ESP32_UART_!RTS  (via drill 0.3)
  Top 0.15: v84.88,39.75 85.38,40.25 v85.38,49.12
  Bottom 0.15: U1.24 86.25,40 R22.2 | R22.2 86,38.5 Q4.3 | R22.2 v84.88,39.75 | R23.1 91.75,51.38 89.5,49.12 v85.38,49.12
ESP32_UART_RX  (via drill 0.3)
  Top 0.15: v81.5,70.12 81.38,70 81.38,60 86.88,54.5 v86.88,42.75
  Bottom 0.15: U1.26 87,41 86.88,41.12 v86.88,42.75 | U5.34 81.45,70.17 v81.5,70.12
ESP32_UART_TX  (via drill 0.3)
  Top 0.15: v80.75,71.38 81,71.12 81,59.88 84.88,56 v84.88,40.5
  Bottom 0.15: U1.25 v84.88,40.5 | U5.35 80.69,71.44 v80.75,71.38
ESP_IO0  (via drill 0.3)
  Top 0.15: v80.12,58.75 81.62,58.75 84.5,55.88 84.5,45 v84.12,44.62
  Bottom 0.15: Q5.2 v84.12,44.62 | R20.1 U5.25 v80.12,58.75
ESP_IO13
  Bottom 0.15: U5.16 91.69,55.93 R23.2
ESP_IO15
  Bottom 0.15: U5.23 82.81,55.93 R24.2
ESP_RS485_DE  (via drill 0.3)
  Top 0.15: v80.12,60 79.12,59 79.12,50.88 78.25,50 v78.25,49.75
  Bottom 0.15: U4.3 U4.2 78.38,48.62 R5.2 v78.25,49.75 | v80.12,60 U5.26
ESP_RS485_UART_RX  (via drill 0.3)
  Top 0.15: v80.12,61.25 80.62,60.75 80.62,59.62 80.38,59.38 80,59.38 79.5,58.88 79.5,51 80.88,49.62 v80.88,48.5
  Bottom 0.15: v80.12,61.25 80.09,61.28 U5.27 | v80.88,48.5 U4.4
ESP_RS485_UART_TX  (via drill 0.3)
  Top 0.15: v77.12,48.5 77.12,49.38 78.75,51 78.75,61.12 v80.12,62.5
  Bottom 0.15: U5.28 80.08,62.55 v80.12,62.5 | v77.12,48.5 U4.1
GND  (via drill 0.3, 0.35, 0.5, 1)
  Bottom 0.15: C12.1 v99.12,69 | R10.1 v24.38,24.38 | C18.1 v24.38,23.12 | C10.1 v24.38,21.88 | C11.1 v24.12,16.62 | R9.1 v21.62,10.38 | R7.1 v20.38,10.38 | R17.1 v49.38,24.38 | C26.1 v49.38,23.12 | C24.1 v49.38,21.88 | C25.1 v49.12,16.62 | R15.1 v48.12,11.75 | R13.1 v45.38,10.38 | R31.1 v74.38,24.38 | C40.1 v74.38,23.12 | C38.1 v74.38,21.88 | C39.1 v74.12,16.62 | R30.1 v71.62,10.38 | R28.1 v70.38,10.38 | R41.1 v99.38,24.38 | C54.1 v99.38,23.12 | C52.1 v99.38,21.88 | C53.1 v99.12,16.62 | R40.1 v96.62,10.38 | R38.1 v95.38,10.38 | R34.2 v81.5,53.38 | U1.3 89.88,41 U1.29 | R3.1 v96.75,39.38 | R2.1 v96.75,41.88 | R5.1 v79.75,49.75
  Bottom 0.25: U11.PAD v80.38,13.12 | U11.1 79.17,13.32 v79.38,13.12 79.62,13.12 79.78,13.28 U11.2 | v96.75,44.38 C2.1 | C1.1 v96.75,43.12 | U1.29 v91.38,39.5
  Bottom 0.3: U2.12 20.35,17.38 U2.PAD 20.12,16.5 | U2.13 19.7,16.07 20.12,16.5 | U2.14 19.05,16.05 19.5,16.5 20.12,16.5 | U2.7 22.95,18.45 22.62,18.12 v21.75,18.12 | U3.12 45.35,17.38 U3.PAD 45.12,16.5 | U3.13 44.7,16.07 45.12,16.5 | U3.14 44.05,16.05 44.5,16.5 45.12,16.5 | U3.7 47.95,18.45 47.62,18.12 v46.75,18.12 | U8.12 70.35,17.38 U8.PAD 70.12,16.5 | U8.13 69.7,16.07 70.12,16.5 | U8.14 69.05,16.05 69.5,16.5 70.12,16.5 | U8.7 72.95,18.45 72.62,18.12 v71.75,18.12 | U10.12 95.35,17.38 U10.PAD 95.12,16.5 | U10.13 94.7,16.07 95.12,16.5 | U10.14 94.05,16.05 94.5,16.5 95.12,16.5 | U10.7 97.95,18.45 97.62,18.12 v96.75,18.12
  Bottom 0.5: v99.12,72.75 C14.1 | C13.1 v99.12,76.25 | U5.1 v94.25,75.25 | U5.38 78.88,75.12 v80.5,75.12 | U5.15 92.97,59.22 v93,59.25 | U5.39 v91.25,67.75 | U5.39 v88.25,70.75 | U5.39 v85.25,67.75 | C19.1 v20.62,22 | C9.1 v20.62,25.5 | R8.1 v15,7 | v16.12,7.88 R8.1 | R8.1 v13.88,7.88 | R8.1 v15,8.75 | C27.1 v45.62,22 | C23.1 v45.62,25.5 | R14.1 v40,7 | R14.1 v41.12,7.88 | R14.1 v38.88,7.88 | R14.1 v40,8.75 | C41.1 v70.62,22 | C37.1 v70.62,25.5 | R29.1 v65,7 | R29.1 v66.12,7.88 | R29.1 v63.88,7.88 | R29.1 v65,8.75 | C55.1 v95.62,22 | C51.1 v95.62,25.25 | R39.1 v90,7 | R39.1 v91.12,7.88 | R39.1 v88.88,7.88 | R39.1 v90,8.75 | D6.A v79.5,20.75 | v79.75,9.62 C30.1 v77.75,9.62 | v79.75,7.62 C29.1 v77.75,7.62 | v79.75,16.88 C31.1 v77.75,16.88 | CN2.GND 89.9,29.52 v89.75,29.38 89.5,29.12 v89,29.12 | v17.12,16.38 C8.1 v15.12,16.38 | C21.1 v11.75,14.38 | v42.12,16.38 C22.1 v40.12,16.38 | C28.1 v36.75,14.38 | v67.12,16.38 C36.1 v65.12,16.38 | C42.1 v61.75,14.38 | C56.1 v86.75,14.38 | v90.12,16.38 C50.1 v92.12,16.38 | U6.2 v84.5,30.88 | C3.1 v88.38,25.62 | C4.1 v87.12,25.62 | v77.25,21 C7.1 v77.25,18.75 | C5.1 v75.88,43.88 | U4.5 v80.88,42.88 | TP2.1 v78.75,35.25 | TP2.1 77.25,34 v76.12,35.12 | TP2.1 v76.25,32.75 | TP2.1 v78.75,32.75
  other vias: 21,17.38 20.25,16.62 21.75,16.62 20.25,18.12 19.5,17.38 22.5,17.38 18.75,18.12 18.75,16.62 23.25,18.12 23.25,16.62 46,17.38 45.25,16.62 46.75,16.62 45.25,18.12 44.5,17.38 47.5,17.38 43.75,18.12 43.75,16.62 48.25,18.12 48.25,16.62 71,17.38 70.25,16.62 71.75,16.62 70.25,18.12 69.5,17.38 72.5,17.38 68.75,18.12 68.75,16.62 73.25,18.12 73.25,16.62 96,17.38 95.25,16.62 96.75,16.62 95.25,18.12 94.5,17.38 97.5,17.38 93.75,18.12 93.75,16.62 98.25,18.12 98.25,16.62 81.38,13.12 89.38,41.5 97,35.62 91.75,35.62 97,26.62 91.75,26.62
  pour GND (rank 6): 0,0 100,0 100,76 0,76
  pour Bottom (rank 2, no thermals): 18.5,19.12 18.5,15.62 23.5,15.62 23.5,19.12
  pour Bottom (rank 2, no thermals): 43.5,19.12 43.5,15.62 48.5,15.62 48.5,19.12
  pour Bottom (rank 2, no thermals): 68.5,19.12 68.5,15.62 73.5,15.62 73.5,19.12
  pour Bottom (rank 2, no thermals): 93.5,19.12 93.5,15.62 98.5,15.62 98.5,19.12
LED0_A  (via drill 0.5)
  Top 1: 12.5,87.5 CN1.P$1 12.46,87.5 12.5,87.46 12.5,19.75 v10.5,17.75 v10.5,17 | 12.5,87.5 CN1.P$2 | CN1.P$3 12.5,87.5
  Bottom 0.15: D2.K 17.62,12.88 R6.2
  Bottom 0.5: C8.2 13.12,16.94 13.07,17 C21.2 v10.5,17 v10.5,17.75
  Bottom 0.8: D2.K 17.25,14.55 14.2,14.55 13.12,15.62 C8.2
LED0_K
  Bottom 0.15: R8.2 18.88,4.88 22.3,8.3 U2.9
  Bottom 0.5: CN3.P$3 R8.2
  Bottom 1: CN3.P$2 12.5,12.5 | 12.5,12.5 CN3.P$1 | 12.5,12.5 CN3.P$3 R8.2
LED1_A  (via drill 0.5)
  Top 1: 37.38,87.5 CN4.P$1 37.46,87.5 37.5,87.46 37.5,19.75 v35.5,17.75 v35.5,17 | 37.38,87.5 CN4.P$2 | CN4.P$3 37.5,87.62 37.38,87.5
  Bottom 0.15: D3.K 42.62,12.88 R12.2
  Bottom 0.5: C22.2 38.12,16.75 37.88,17 C28.2 v35.5,17 v35.5,17.75
  Bottom 0.8: D3.K 42.25,14.55 39.2,14.55 38.12,15.62 C22.2
LED1_K
  Bottom 0.15: R14.2 43.5,4.88 46.12,7.5 46.12,11.12 47.3,12.3 U3.9
  Bottom 0.5: CN5.P$3 R14.2
  Bottom 1: CN5.P$2 37.5,12.5 | 37.5,12.5 CN5.P$1 | 37.5,12.5 CN5.P$3 R14.2
LED2_A  (via drill 0.5)
  Top 1: 62.5,87.5 CN6.P$1 62.46,87.5 62.46,19.71 v60.5,17.75 v60.5,17 | 62.5,87.5 CN6.P$2 | CN6.P$3 62.5,87.5
  Bottom 0.15: D5.K 67.62,12.88 R27.2
  Bottom 0.5: C36.2 63.12,16.88 63,17 C42.2 v60.5,17 v60.5,17.75
  Bottom 0.8: D5.K 67.25,14.55 64.2,14.55 63.12,15.62 C36.2
LED2_K
  Bottom 0.15: R29.2 68.88,4.88 72.3,8.3 U8.9
  Bottom 1: CN7.P$2 62.5,12.5 | 62.5,12.5 CN7.P$1 | 62.5,12.5 CN7.P$3 R29.2
LED3_A  (via drill 0.5)
  Top 1: CN8.P$1 87.38,87.5 | 87.38,87.5 CN8.P$2 | CN8.P$3 87.5,87.62 | 87.5,87.62 87.38,87.5 | v84.62,17 v85.38,17 98.38,30 98.38,66.25 87.5,77.12 87.5,87.62
  Bottom 0.15: D7.K 92.62,12.88 R37.2
  Bottom 0.5: C50.2 88.12,16.88 88,17 C56.2 v85.38,17 v84.62,17
  Bottom 0.8: D7.K 92.25,14.55 89.2,14.55 88.12,15.62 C50.2
LED3_K
  Bottom 0.15: U10.9 97.3,9.18 93,4.88 R39.2
  Bottom 1: CN9.P$2 87.5,12.5 | 87.5,12.5 CN9.P$1 | 87.5,12.5 CN9.P$3 R39.2
LED_PWM_0
  Bottom 0.15: U10.4 96,21.25 96.25,21.5 96.25,23.75 R41.2 97.75,25.25 98.38,25.25 99.5,26.38 99.5,43.5 97.12,45.88 87,45.88 83.75,49.12 83.75,54.62 83.25,55.12 79,55.12 75.88,58.25 75.88,62.5 77.19,63.82 U5.29
LED_PWM_1  (via drill 0.3)
  Top 0.15: v71.88,29.12 v71.88,25.38
  Bottom 0.15: U8.4 71,21.25 71.25,21.5 71.25,23.75 R31.2 v71.88,25.38 | U5.30 74.59,65.09 71.88,62.38 v71.88,29.12
LED_PWM_2  (via drill 0.3)
  Top 0.15: v46.88,29.12 v46.88,25.38
  Bottom 0.15: U3.4 46,21.25 46.25,21.5 46.25,23.75 R17.2 v46.88,25.38 | U5.31 75.36,66.36 46.88,37.88 v46.88,29.12
LED_PWM_3  (via drill 0.3)
  Top 0.15: v21.88,29.12 v21.88,25.38
  Bottom 0.15: U2.4 21,21.25 21.25,21.5 21.25,23.75 R10.2 v21.88,25.38 | U5.33 77.4,68.9 37.62,29.12 v21.88,29.12
N$1
  Bottom 0.15: U1.8 94.12,42 R2.2 94.88,41.25 R1.2
N$2
  Bottom 0.15: U1.9 93.5,41.5 93.62,41.38 93.62,41.25 R4.1
N$3
  Bottom 0.15: U1.11 93.5,40.5 93.62,40.38 93.62,40 R3.2
N$5
  Bottom 1.5: D1.A D4.A TP1.1
N$6
  Bottom 0.15: U2.5 21.65,21.65 C10.2
N$7
  Bottom 0.25: U1.6 U1.7 94.12,43 C1.2 C2.2
N$8
  Bottom 0.15: U2.10 21.65,12.9 R9.2
N$9
  Bottom 0.15: C18.2 22.62,22.38 22.62,21.38 22.3,21.05 U2.6
N$10
  Bottom 0.15: C11.2 23.02,14.12 22.95,14.2 U2.8
N$11
  Bottom 0.15: U2.11 21,13.5 R7.2 R6.1
N$12
  Bottom 0.25: 19.25,20.12 19.2,20.18 U2.1
  Bottom 0.3: U2.2 U2.1
  Bottom 0.8: D2.A 17.62,19.25 17.38,19.5
  Bottom 1: 19.25,20.12 18.5,20.12 17.88,19.5 17.38,19.5 15.5,19.5 L2.2
N$13
  Bottom 0.15: U5.24 81.53,55.91 R34.1
N$14
  Bottom 0.15: U3.5 46.65,21.65 C24.2
N$15
  Bottom 0.15: U3.10 46.65,12.9 R15.2
N$16
  Bottom 0.15: C26.2 47.62,22.38 47.62,21.38 47.3,21.05 U3.6
N$17
  Bottom 0.15: C25.2 48.02,14.12 47.95,14.2 U3.8
N$18
  Bottom 0.15: U3.11 46,13.5 R13.2 R12.1
N$19
  Bottom 0.25: 44.25,20.12 44.2,20.18 U3.1
  Bottom 0.3: U3.2 U3.1
  Bottom 0.8: D3.A 42.62,19 42.12,19.5
  Bottom 1: 44.25,20.12 43.5,20.12 42.88,19.5 42.12,19.5 40.5,19.5 L3.2
N$20
  Bottom 0.5: CN2.VCC 88.9,32.73 FB1.1
N$26
  Bottom 0.15: U8.5 71.65,21.65 C38.2
N$27
  Bottom 0.15: U8.10 71.65,12.9 R30.2
N$28
  Bottom 0.15: C40.2 72.62,22.38 72.62,21.38 72.3,21.05 U8.6
N$29
  Bottom 0.15: C39.2 73.03,14.12 72.95,14.2 U8.8
N$30
  Bottom 0.15: U8.11 71,13.5 R28.2 R27.1
N$31
  Bottom 0.25: 69.25,20.12 69.2,20.18 U8.1
  Bottom 0.3: U8.2 U8.1
  Bottom 0.8: D5.A 67.62,19.25 67.88,19.5
  Bottom 1: 69.25,20.12 68.5,20.12 67.88,19.5 65.5,19.5 L5.2
N$38
  Bottom 0.15: U10.5 96.65,21.65 C52.2
N$39
  Bottom 0.15: U10.10 96.65,12.9 R40.2
N$40
  Bottom 0.15: C54.2 97.62,22.38 97.62,21.38 97.3,21.05 U10.6
N$41
  Bottom 0.15: C53.2 98.03,14.12 97.95,14.2 U10.8
N$42
  Bottom 0.15: U10.11 96,13.5 R38.2 R37.1
N$43
  Bottom 0.25: 94.25,20.12 94.2,20.18 U10.1
  Bottom 0.3: U10.2 U10.1
  Bottom 0.8: D7.A 92.62,19.25 92.88,19.5
  Bottom 1: 94.25,20.12 93.5,20.12 92.88,19.5 90.5,19.5 L7.2
N$95
  Bottom 0.25: 88.59,31.82 U6.4 88.72,31.82 arc-45 89.07,31.68 89.23,31.52 arc45 89.5,31.41 arc45 90.2,31.7 90.38,31.88 arc-45 90.5,31.93 CN2.D-
N$96
  Bottom 0.25: U6.6 88.47,29.93 arc45 88.82,30.07 89.48,30.73 arc-45 90.44,31.12 CN2.D+
N$97  (via drill 0.3)
  Top 0.25: v91,44.12 arc45 90.88,43.82 90.88,41.58 arc-45 90.73,41.23 82.9,33.4 arc45 82.75,33.04 82.75,31.62 arc90 83.25,31.12 83.45,31.12 arc45 v83.75,31.25
  Bottom 0.25: U1.5 90.88,43.82 arc-45 v91,44.12 | v83.75,31.25 84.18,31.68 arc-45 84.53,31.82 U6.3
N$98  (via drill 0.3)
  Top 0.25: v90.25,44.12 arc-45 90.38,43.82 90.38,41.71 arc-45 90.32,41.57 82.54,33.79 arc45 82.25,33.09 82.25,31.62 arc90 83.25,30.62 83.45,30.62 arc-45 v83.75,30.5
  Bottom 0.25: U1.4 90.38,43.82 arc45 v90.25,44.12 | v83.75,30.5 84.18,30.07 arc45 84.53,29.93 U6.1
N$99
  Bottom 0.15: R21.1 83.75,38.5 Q4.1
N$100
  Bottom 0.15: Q5.1 86,42.5 R22.1
RS485_A
  Bottom 0.5: TP3.1 79.38,38.12 79.38,39.62 R18.2 79.62,40.12 U4.6
RS485_B
  Bottom 0.5: TP4.1 78.62,38.12 78.62,39.62 R18.1 78.38,40.12 U4.7
VIN
  Bottom 0.25: C31.2 81.88,16.12 80.97,15.22 U11.4 U11.3 80.38,14.62
  Bottom 1: C31.2 81.88,22.88
  pour Bottom (no thermals): 11.88,28.62 11.88,21.5 19.12,21.5 19.75,20.88 19.75,19.5 20.62,19.5 20.62,21.38 19.88,22.12 19.88,28.62
  pour Bottom (no thermals): 33.88,28.62 33.88,21.5 44.12,21.5 44.75,20.88 44.75,19.5 45.62,19.5 45.62,21.38 44.88,22.12 44.88,28.62
  pour Bottom (no thermals): 11.88,28.62 11.88,21.5 69.12,21.5 69.75,20.88 69.75,19.5 70.62,19.5 70.62,21.38 69.88,22.12 69.88,25.38 75.25,25.38 75.25,21.5 86.25,21.5 86.25,28.62
  pour Bottom (no thermals): 83.88,25.25 83.88,21.5 94.12,21.5 94.75,20.88 94.75,19.5 95.62,19.5 95.62,21.38 94.88,22.12 94.88,25.25